# Altium schematic sheet Raspi.SchDoc
size A4
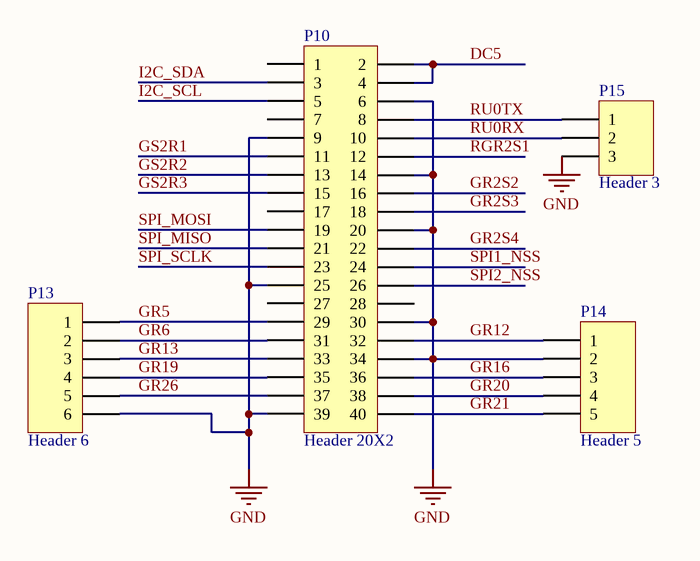
[diagram p0: Raspi.SchDoc]

## Parts
P10  Header 20X2  [HDR2X20]
P13  Header 6  [HDR1X6]
P14  Header 5  [HDR1X5]
P15  Header 3  [HDR1X3]

## Nets
GND: P10.6 P10.9 P10.14 P10.20 P10.25 P10.30 P10.34 P10.39 P13.6 P14.2 P15.3
DC5: P10.2 P10.4
GR2S2: P10.16
GR2S3: P10.18
GR2S4: P10.22
GR5: P10.29 P13.1
GR6: P10.31 P13.2
GR12: P10.32 P14.1
GR13: P10.33 P13.3
GR16: P10.36 P14.3
GR19: P10.35 P13.4
GR20: P10.38 P14.4
GR21: P10.40 P14.5
GR26: P10.37 P13.5
GS2R1: P10.11
GS2R2: P10.13
GS2R3: P10.15
I2C_SCL: P10.5
I2C_SDA: P10.3
RGR2S1: P10.12
RU0RX: P10.10 P15.2
RU0TX: P10.8 P15.1
SPI1_NSS: P10.24
SPI2_NSS: P10.26
SPI_MISO: P10.21
SPI_MOSI: P10.19
SPI_SCLK: P10.23

Not connected (* = marked no-connect by the designer): P10 1 7 17 27 28

## Library data of the parts
P10 = Header 20X2: Header, 20-Pin, Dual row; LatestRevisionDate: 17-Jul-2002; LatestRevisionNote: Re-released for DXP Platform.; Publisher: Altium Limited
P13 = Header 6: Header, 6-Pin; LatestRevisionDate: 17-Jul-2002; LatestRevisionNote: Re-released for DXP Platform.; Publisher: Altium Limited
P14 = Header 5: Header, 5-Pin; LatestRevisionDate: 17-Jul-2002; LatestRevisionNote: Re-released for DXP Platform.; Publisher: Altium Limited
P15 = Header 3: Header, 3-Pin; LatestRevisionDate: 17-Jul-2002; LatestRevisionNote: Re-released for DXP Platform.; Publisher: Altium Limited